# Altium schematic sheet Magnetic_Stage.SchDoc: PFC Inductor Board
size A4; ApprovedBy: Hamit Can Dinç; CheckedBy: Hamit Can Dinç; Author: Hamit Can Dinç; CompanyName: Hamit Can Dinç; DrawnBy: Hamit Can Dinç; Engineer: Hamit Can Dinç; Organization: YTU Master; Revision: 1; SheetNumber: 2; SheetTotal: 2
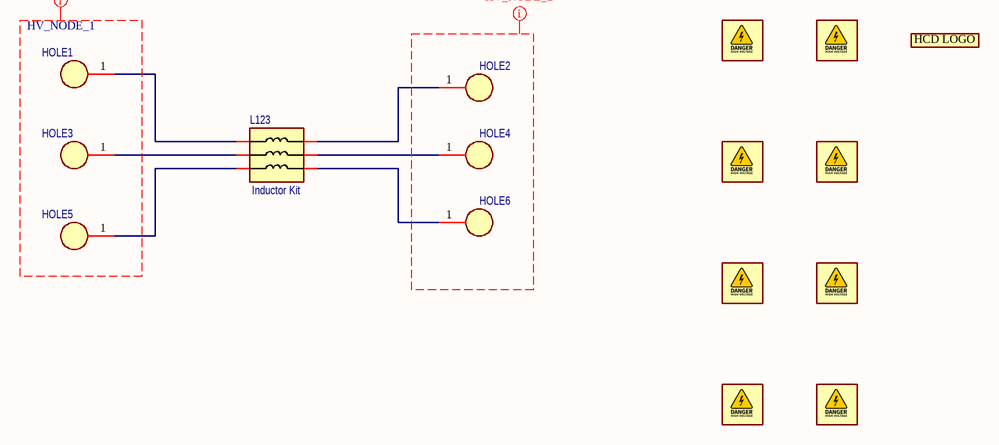
[diagram p0: Magnetic_Stage.SchDoc]

## Parts
HOLE1  HOLE_CIRC_1POS_NO_BOM  [HOLE_M4_4.5_12SQ]  (value not drawn)  (no BOM)
HOLE2  HOLE_CIRC_1POS_NO_BOM  [HOLE_M4_4.5_12SQ]  (value not drawn)  (no BOM)
HOLE3  HOLE_CIRC_1POS_NO_BOM  [HOLE_M4_4.5_12SQ]  (value not drawn)  (no BOM)
HOLE4  HOLE_CIRC_1POS_NO_BOM  [HOLE_M4_4.5_12SQ]  (value not drawn)  (no BOM)
HOLE5  HOLE_CIRC_1POS_NO_BOM  [HOLE_M4_4.5_12SQ]  (value not drawn)  (no BOM)
HOLE6  HOLE_CIRC_1POS_NO_BOM  [HOLE_M4_4.5_12SQ]  (value not drawn)  (no BOM)
L123  Inductor_3ph  [IND_3PH_SET_20A]  (value not drawn)
LOGO1  HIGH_VOLTAGE_LOGO  [HV_LOGO]  (value not drawn)  (no BOM)
LOGO2  HIGH_VOLTAGE_LOGO  [HV_LOGO]  (value not drawn)  (no BOM)
LOGO3  HIGH_VOLTAGE_LOGO  [HV_LOGO]  (value not drawn)  (no BOM)
LOGO4  HIGH_VOLTAGE_LOGO  [HV_LOGO]  (value not drawn)  (no BOM)
LOGO5  HIGH_VOLTAGE_LOGO  [HV_LOGO]  (value not drawn)  (no BOM)
LOGO6  HIGH_VOLTAGE_LOGO  [HV_LOGO]  (value not drawn)  (no BOM)
LOGO7  HIGH_VOLTAGE_LOGO  [HV_LOGO]  (value not drawn)  (no BOM)
LOGO8  HIGH_VOLTAGE_LOGO  [HV_LOGO]  (value not drawn)  (no BOM)
LOGO1000  HCD_LOGO  [HCD_LOGO_V1]  (value not drawn)  (no BOM)

## Nets
NetHOLE1_1: HOLE1.1 L123.1
NetHOLE2_1: HOLE2.1 L123.2
NetHOLE3_1: HOLE3.1 L123.3
NetHOLE4_1: HOLE4.1 L123.4
NetHOLE5_1: HOLE5.1 L123.5
NetHOLE6_1: HOLE6.1 L123.6

## Layout directives
net class HV_NODE_1: (no net found under the mark)
net class HV_NODE_2: (no net found under the mark)

## Notes on the sheet
- (in symbol HCD_LOGO_V1) HCD LOGO

## Library data of the parts
HOLE1-HOLE6 = HOLE_M4_4.5_12SQ: 4.5mm hole size 12X12 mm hole for M4; Identifier: HOLE_M4_4.5_12SQ; Component Type: Hole
L123 = INDKIT_235UH_35A_100KHZ_THD_DT6: CORE Electronic DT6 235uH Inductor 3 kit; Manufacturer PN: DT6 X 3; Current: 35A; Tolerance: ±12%; Lead Status: ROHS3 Compliant; Temp# Operating: max 130C; Identifier: INDKIT_235UH_35A_100KHZ_THD_DT6; Component Type: Inductor Kit; Distributor: Depot; Status: Active; Manufacturer: Core Electronic; Value: 235uH; Package: N/A; Height: 50mm; Cost: N/A; MSL: 1; Mounting Type: THD; Temp# Storage: N/A; Features: 2,00 HGR2 Emaye Bobin Teli
LOGO1-LOGO8 = HIGH_VOLTAGE_LOGO_SILK: Silk Screen High Voltage Logo; Identifier: HIGH_VOLTAGE_LOGO_SILK; Component Type: HV Logo
LOGO1000 = HCD_LOGO_V1: Hamit Can Dinç LOGO; Identifier: HCD_LOGO_V1; Component Type: LOGO